# EAGLE design 9-23cmcontrol (EAGLE 4.16)
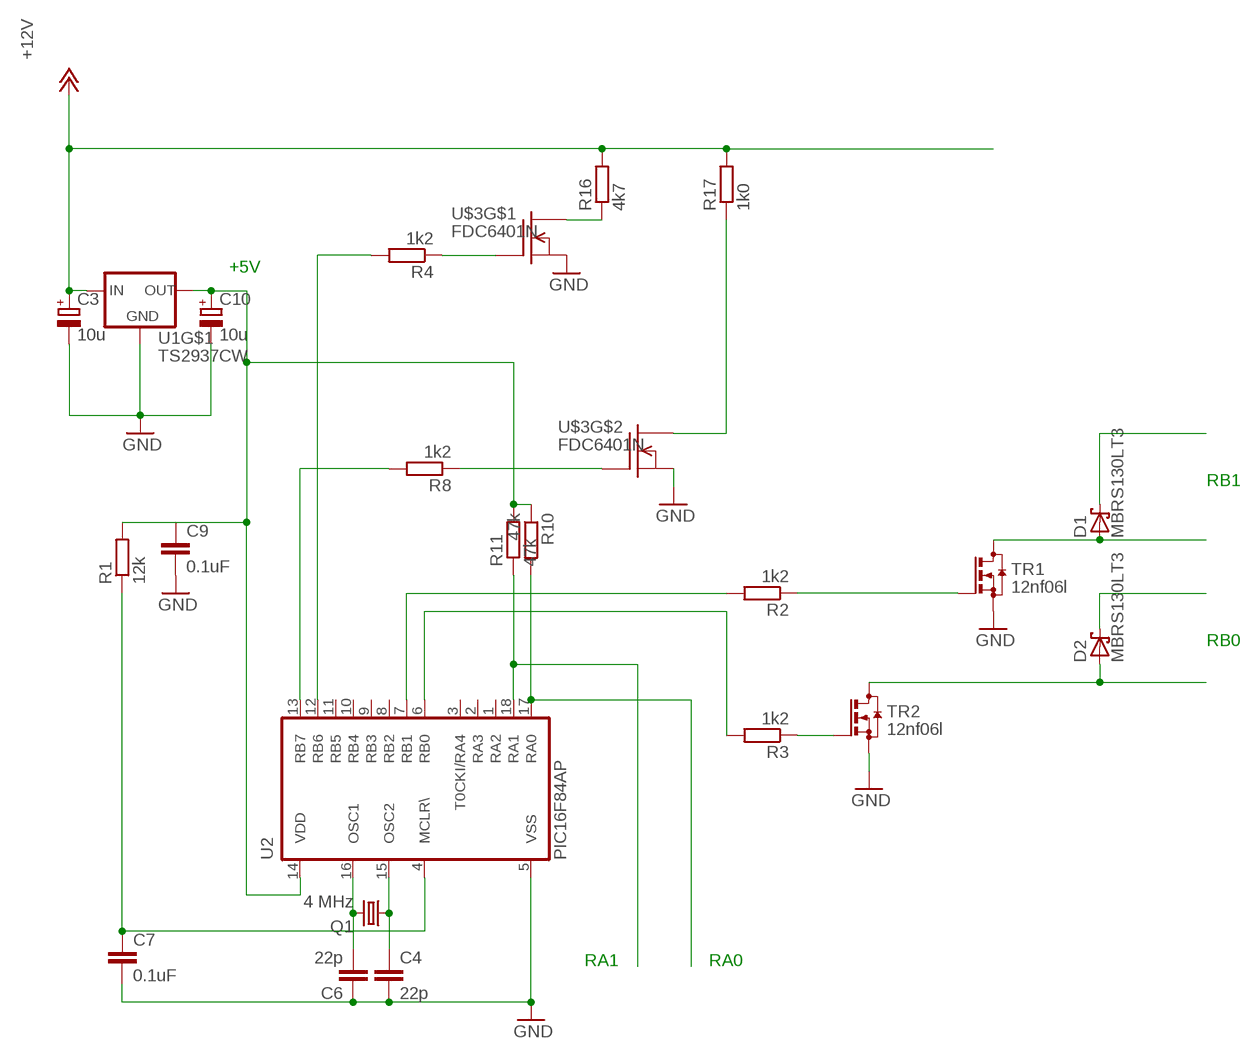
[diagram p0: schematic, sheet 1]

## Parts
C3  10u  CPOL-EUSANYO_SMD_B6  [SANYO-OSCON_SMD_B6]
C4  22p  C-EUC0805  [C0805]
C6  22p  C-EUC0805  [C0805]
C7  0.1uF  C-EUC0805  [C0805]
C9  0.1uF  C-EUC0805  [C0805]
C10  10u  CPOL-EUSANYO_SMD_B6  [SANYO-OSCON_SMD_B6]
D1  MBRS130LT3  [SMB]
D2  MBRS130LT3  [SMB]
Q1  4 MHz  CRYSTALHC49U-V  [HC49U-V]
R1  12k  R-EU_M0805  [M0805]
R2  1k2  R-EU_R0805  [R0805]
R3  1k2  R-EU_R0805  [R0805]
R4  1k2  R-EU_R0805  [R0805]
R8  1k2  R-EU_R0805  [R0805]
R10  47k  R-EU_M0805  [M0805]
R11  47k  R-EU_M0805  [M0805]
R16  4k7  R-EU_M0805  [M0805]
R17  1k0  R-EU_M0805  [M0805]
TR1  12nf06l  FDD8580  [D-PACK]
TR2  12nf06l  FDD8580  [D-PACK]
U1  TS2937CW  [SOT223]
U2  PIC16F84AP  [DIL18]
U$3  FDC6401N  [SOT23-6L]

## Nets
+12V: C3.+ R16.2 R17.2 U1.1(IN)
GND: C3.- C4.2 C6.1 C7.2 C9.2 C10.- TR1.3(S) TR2.3(S) U1.2(GND) U2.5(VSS) U$3.2(S) U$3.5(S)
N$1: C6.2 Q1.2 U2.16(OSC1)
N$2: C9.1 C10.+ R1.2 R10.1 R11.2 U1.3(OUT) U2.14(VDD)
N$3: D1.C
N$4: C4.1 Q1.1 U2.15(OSC2)
N$5: R8.1 U$3.3(G)
N$6: R17.1 U$3.4(D)
N$7: R10.2 U2.17(RA0)
N$8: R3.1 TR2.1(G)
N$9: R8.2 U2.13(RB7)
N$10: R2.1 TR1.1(G)
N$11: D2.A TR2.4(D)
N$12: D2.C
N$13: R2.2 U2.7(RB1)
N$14: R4.2 U2.12(RB6)
N$15: R16.1 U$3.6(D)
N$21: R4.1 U$3.1(G)
N$40: C7.1 R1.1 U2.4(MCLR\)
N$41: R3.2 U2.6(RB0)
N$44: D1.A TR1.4(D)
N$47: R11.1 U2.18(RA1)
Unconnected: U2.1(RA2) U2.2(RA3) U2.3(T0CKI/RA4) U2.8(RB2) U2.9(RB3) U2.10(RB4) U2.11(RB5)

## Notes on the sheet
- +5V
- RB1
- RB0
- RA1 | RA0

## Power pins joined to a net without a drawn wire
GND: U1.4(GND)

## Library data of the parts
C3 C10 = rcl:CPOL-EU: POLARIZED CAPACITOR, European symbol
C4 C6 C7 C9 = rcl:C-EU: CAPACITOR, European symbol
D1 D2 = diode:MBRS130LT3: Schottky Power Rectifier Source: http://www.onsemi.com/pub/Collateral/MBRS130LT3-D.PDF
Q1 = crystal:CRYSTAL: CRYSTAL
R1-R4 R8 R10 R11 R16 R17 = rcl:R-EU_: RESISTOR, European symbol
TR1 TR2 = g4bao:FDD8580
U1 = v-reg-2:TS2937CW
U2 = microchip:PIC16F8*: MICROCONTROLLER 8-Bit PIC16F8X Family - CMOS Flash/EEPROM Pin Compatible : PIC16F83, PIC16CR83, PIC16F84A, PIC16CR84 see also PIC16C*
U$3 = transistor-fet:FDC6401N

## Board
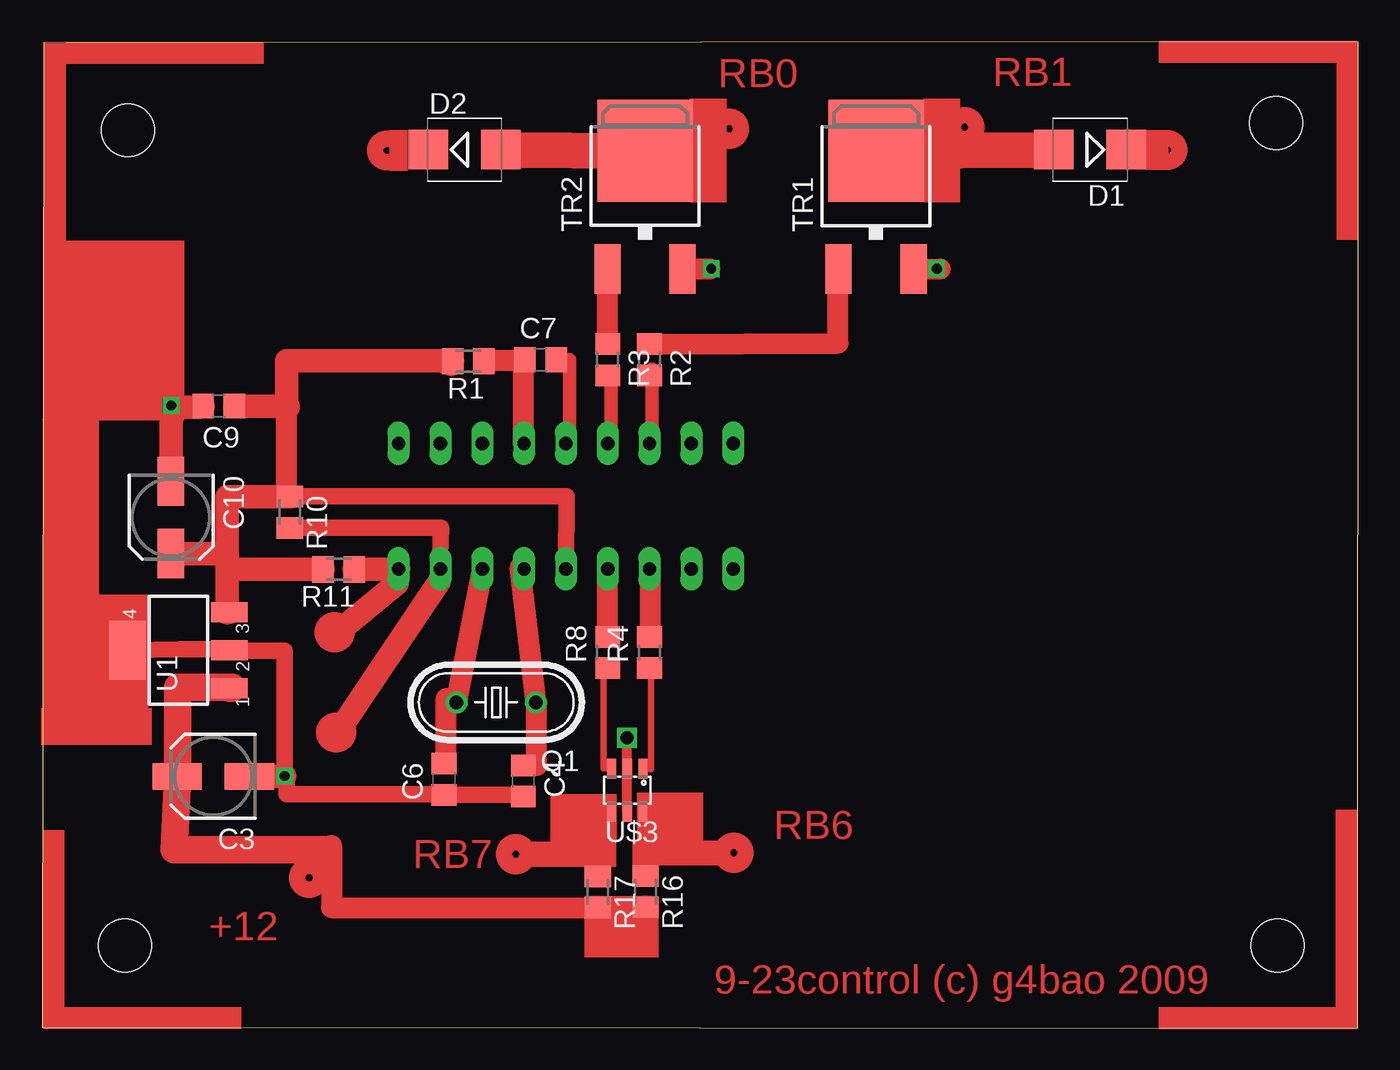
[diagram p1: board, top side]
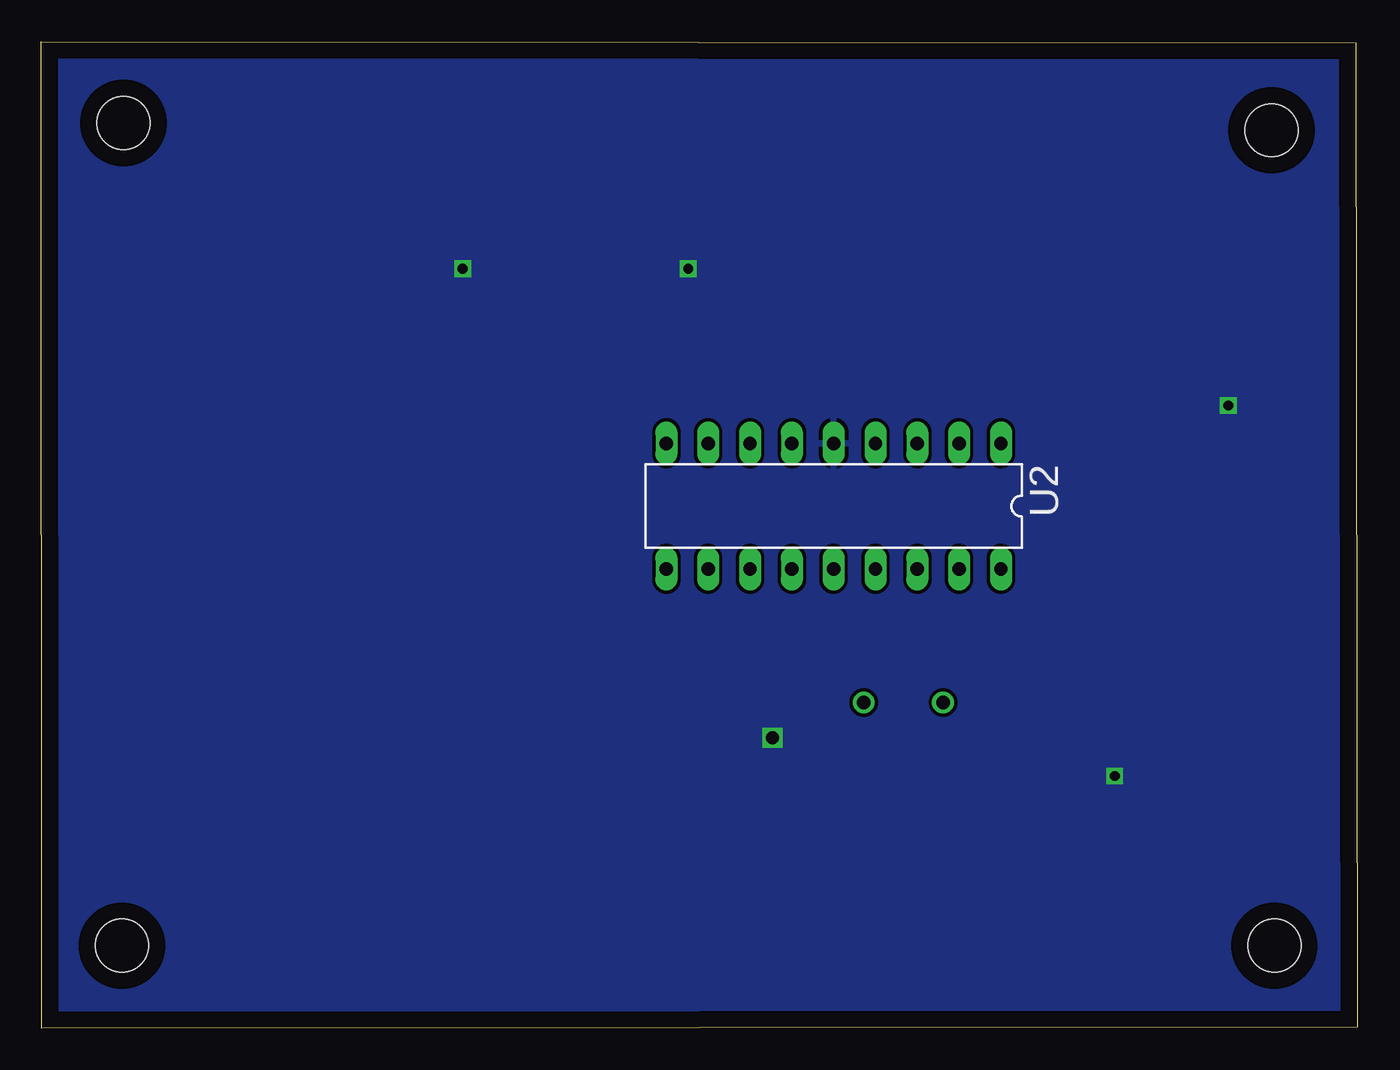
[diagram p2: board, bottom side, seen from below]

Size 79.92 x 59.88 mm. Coordinates in mm from the lower left corner, seen from the top.
Outline: 0,0.04 79.89,0 79.92,59.88 0.07,59.83 0,0.04
Copper layers (1*16): Top 0.035mm / dielectric 1.5mm / Bottom 0.035mm
Design rules "default": minimum track width 10mil, minimum drill 24mil, track to track 8mil, track to pad 8mil, pad to pad 8mil, via to via 8mil, smd to smd 8mil, copper to edge 40mil, drill to drill 8mil, minimum pad ring 10mil, minimum via ring 8mil, stop-mask expansion 4mil, vias tented up to drill 0mil, thermal gap 10mil
Holes 3.2 mm at 5.2,54.52 5.03,5.01 75.03,5.01 74.94,54.96

### Footprints (pad centres in the part's own frame; a part is rotated, then mirrored left to right if it is on the bottom)
SANYO-OSCON_SMD_B6 = smd 3 x 1.6: + 2.2,0; - -2.2,0
C0805 = smd 1.3 x 1.5: 1 -0.95,0; 2 0.95,0
SMB = smd 2.4 x 2.4: A 2.2,0; C -2.2,0
HC49U-V = drill 0.813 round: 1 -2.413,0; 2 2.413,0
M0805 = smd 1.3 x 1.6: 1 -0.95,0; 2 0.95,0
R0805 = smd 1.3 x 1.5: 1 -0.95,0; 2 0.95,0
D-PACK = smd 1.6 x 3: 1 -1.01,-6.07; 3 3.55,-6.07 | smd 5.8 x 6.2: 4 1.27,1.11
SOT223 = smd 1.219 x 2.235: 1 -2.311,-3.099; 2 0,-3.099; 3 2.311,-3.099 | smd 3.6 x 2.2: 4 0,3.099
DIL18 = drill 0.813 long: 1 -10.16,-3.81; 2 -7.62,-3.81; 3 -5.08,-3.81; 4 -2.54,-3.81; 5 0,-3.81; 6 2.54,-3.81; 7 5.08,-3.81; 8 7.62,-3.81; 9 10.16,-3.81; 10 10.16,3.81; 11 7.62,3.81; 12 5.08,3.81; 13 2.54,3.81; 14 0,3.81; 15 -2.54,3.81; 16 -5.08,3.81; 17 -7.62,3.81; 18 -10.16,3.81
SOT23-6L = smd 0.55 x 1.2: 1 -0.95,-1.3; 2 0,-1.3; 3 0.95,-1.3; 4 0.95,1.3; 5 0,1.3; 6 -0.95,1.3

### Placement (x,y rotation side)
C3  10.39,15.29 180 top
C4  29.22,15.01 270 top
C6  24.4,15.11 90 top
C7  30.26,40.59 0 top
C9  10.72,37.77 180 top
C10  7.82,31.01 270 top
D1  63.63,53.34 180 top
D2  25.65,53.34 0 top
Q1  27.57,19.77 180 top
R1  25.88,40.49 180 top
R2  36.88,40.59 270 top
R3  34.34,40.59 270 top
R4  36.88,22.81 90 top
R8  34.34,22.81 90 top
R10  15.04,31.33 270 top
R11  18,27.86 180 top
R16  36.64,8.29 270 top
R17  33.74,8.27 270 top
TR1  49.37,52.16 0 top
TR2  35.34,52.17 0 top
U1  8.27,22.94 90 top
U2  31.8,31.7 180 bottom
U$3  35.53,14.44 180 top

### Tracks (layer width: path | path; a pad name or v marks a point on that pad's centre or on a via)
+12V
  Top 1.016: 11.33,20.61 11.33,20.63 U1.1
  Top 1.27: 8.23,15.41 8.23,15.29 C3.+ 8.33,15.29 | R17.2 17.56,7.32 17.56,11.09 17.3,10.83
  Top 1.422: R16.2 36.73,7.31 R17.2
  Top 1.676: 17.3,10.83 8,10.83 8.23,15.29 | 8.23,15.41 8.23,20.71 11.53,20.71 11.53,20.63 U1.1
GND  (via drill 0.6, 0.8)
  Top 0.254: 14.73,15.29 15.03,15.01 v14.73,15.31
  Top 0.61: U$3.5 U$3.2 v35.51,17.64 | 40.53,46.11 v40.63,46.11 | 54.53,46.11 v54.33,46.11
  Top 0.813: C6.1 24.03,14.16 24.03,14.01 | C4.2 29.53,14.06 29.53,14.01 | U2.5 32.03,35.51 32.03,40.59 C7.2
  Top 1.016: U1.4 8.33,23.01 11.63,23.01 U1.2 11.33,22.94 11.33,22.91 14.73,22.91 v14.73,15.31 14.73,15.29 14.83,15.29 14.83,14.21 24.43,14.21 24.43,14.16 | 24.43,14.16 C6.1 | 29.03,14.06 29.03,14.01 | 29.03,14.06 C4.2 | 24.43,14.16 29.03,14.16 29.03,14.06
  Top 1.27: TR2.3 40.53,46.11 | TR1.3 54.53,46.11
  Top 1.422: C3.- 14.73,15.29 | C10.- v7.83,37.81 7.83,37.71 9.53,37.71 9.53,37.77 C9.2
  pour Bottom: 0.16,60.06 80.16,60.26 80.16,-0.36 0.16,-0.36
N$1
  Top 0.254: C6.2 24.03,16.01
  Top 0.813: C6.2 24.53,16.06 | Q1.2 25.03,19.77 25.03,20.01 24.53,20.01 | 26.73,27.81 U2.16
  Top 1.27: 24.53,16.06 24.53,20.01 | Q1.2 26.73,27.81
N$2
  Top 1.016: 14.83,37.72 14.83,37.81 | U2.14 31.83,32.31 15.03,32.31 R10.1
  Top 1.27: R10.1 14.83,32.28 14.83,37.61 14.83,37.72
  Top 1.422: 24.83,40.31 24.83,40.49 R1.2 24.53,40.49 | 24.53,40.49 24.53,40.41 | 24.53,40.49 24.53,40.51 14.83,40.51 14.83,37.61 | U1.3 11.23,25.25 11.23,27.87 | 11.23,28.81 C10.+ | 11.23,27.87 11.23,28.81 | 11.23,27.87 11.23,25.21 | R10.1 11.23,32.28 11.23,28.81 | 14.93,37.72 14.93,37.71 | 14.83,37.72 14.93,37.72 | C9.1 14.93,37.77 14.93,37.72 | 11.23,27.87 11.41,27.87 R11.2
N$4
  Top 0.813: 30.03,20.01 30.03,19.77 Q1.1 | C4.1 30.03,15.96 | 29.03,28.01 U2.15
  Top 1.27: 30.03,15.96 30.03,19.77 | Q1.1 29.03,28.01
N$5
  Top 0.406: U$3.3 34.1,15.77 34.1,21.89 R8.1
N$6
  Top 0.61: U$3.4 34.53,13.14 34.53,10.58 R17.1
N$7
  Top 1.016: U2.17 24.13,27.89 24.23,30.38 R10.2
N$8
  Top 0.305: R3.1
  Top 0.61: R3.1 34.63,41.54
  Top 1.27: TR2.1 34.33,45.81 R3.1
N$9
  Top 0.813: R8.2 34.33,23.91
  Top 1.27: 34.33,23.91 U2.13
N$10
  Top 0.406: R2.1 36.53,41.54
  Top 1.27: R2.1 48.33,41.58 48.33,46.01 TR1.1
N$11
  Top 1.422: D2.A 27.72,53.32
  Top 2.184: 27.72,53.32 TR2.4
N$13
  Top 0.813: 37.03,39.64 37.03,40.01 | 37.03,39.64 R2.2 | U2.7 37.03,35.51 37.03,39.64
N$14
  Top 0.813: R4.2 37.03,23.51
  Top 1.27: R4.2 36.93,23.81 36.93,27.84 U2.12
N$15
  Top 0.406: U$3.6 36.53,13.14 36.53,9.24 R16.1
N$18
  Top 1.422: 17.95,24.02 21.56,27.02
N$19
  Top 1.422: 17.95,17.94 24.1,27.1
N$21
  Top 0.406: 36.97,21.83 37.03,22.01 | 36.97,21.83 R4.1 | U$3.1 36.97,15.71 36.97,21.83
N$40
  Top 0.813: C7.1 29.03,40.51
  Top 1.27: 29.23,40.59 29.23,40.71 | 29.23,40.59 C7.1 | U2.4 29.23,35.51 29.23,40.59 | 26.83,40.51 R1.1 | 29.03,40.51 26.83,40.51 | 26.83,40.51 26.83,40.61
N$41
  Top 0.813: R3.2 34.53,39.64 34.53,35.51 U2.6
N$44
  Top 1.422: 61.16,53.32 D1.A
  Top 2.184: TR1.4 61.16,53.32
N$47
  Top 1.016: 21.63,27.91 U2.18
  Top 1.422: U2.18 21.56,27.87 R11.1
(copper drawn outside any net)
  shapes: Top area x23, Top circle x9

### Text on the board
Top: RB0 | RB1 | RB6 | RB7 | +12 | 9-23control (c) g4bao 2009